# EasyEDA Pro project WCH电调V3.1（OP）.eprj

# Schematic 2024.4.3
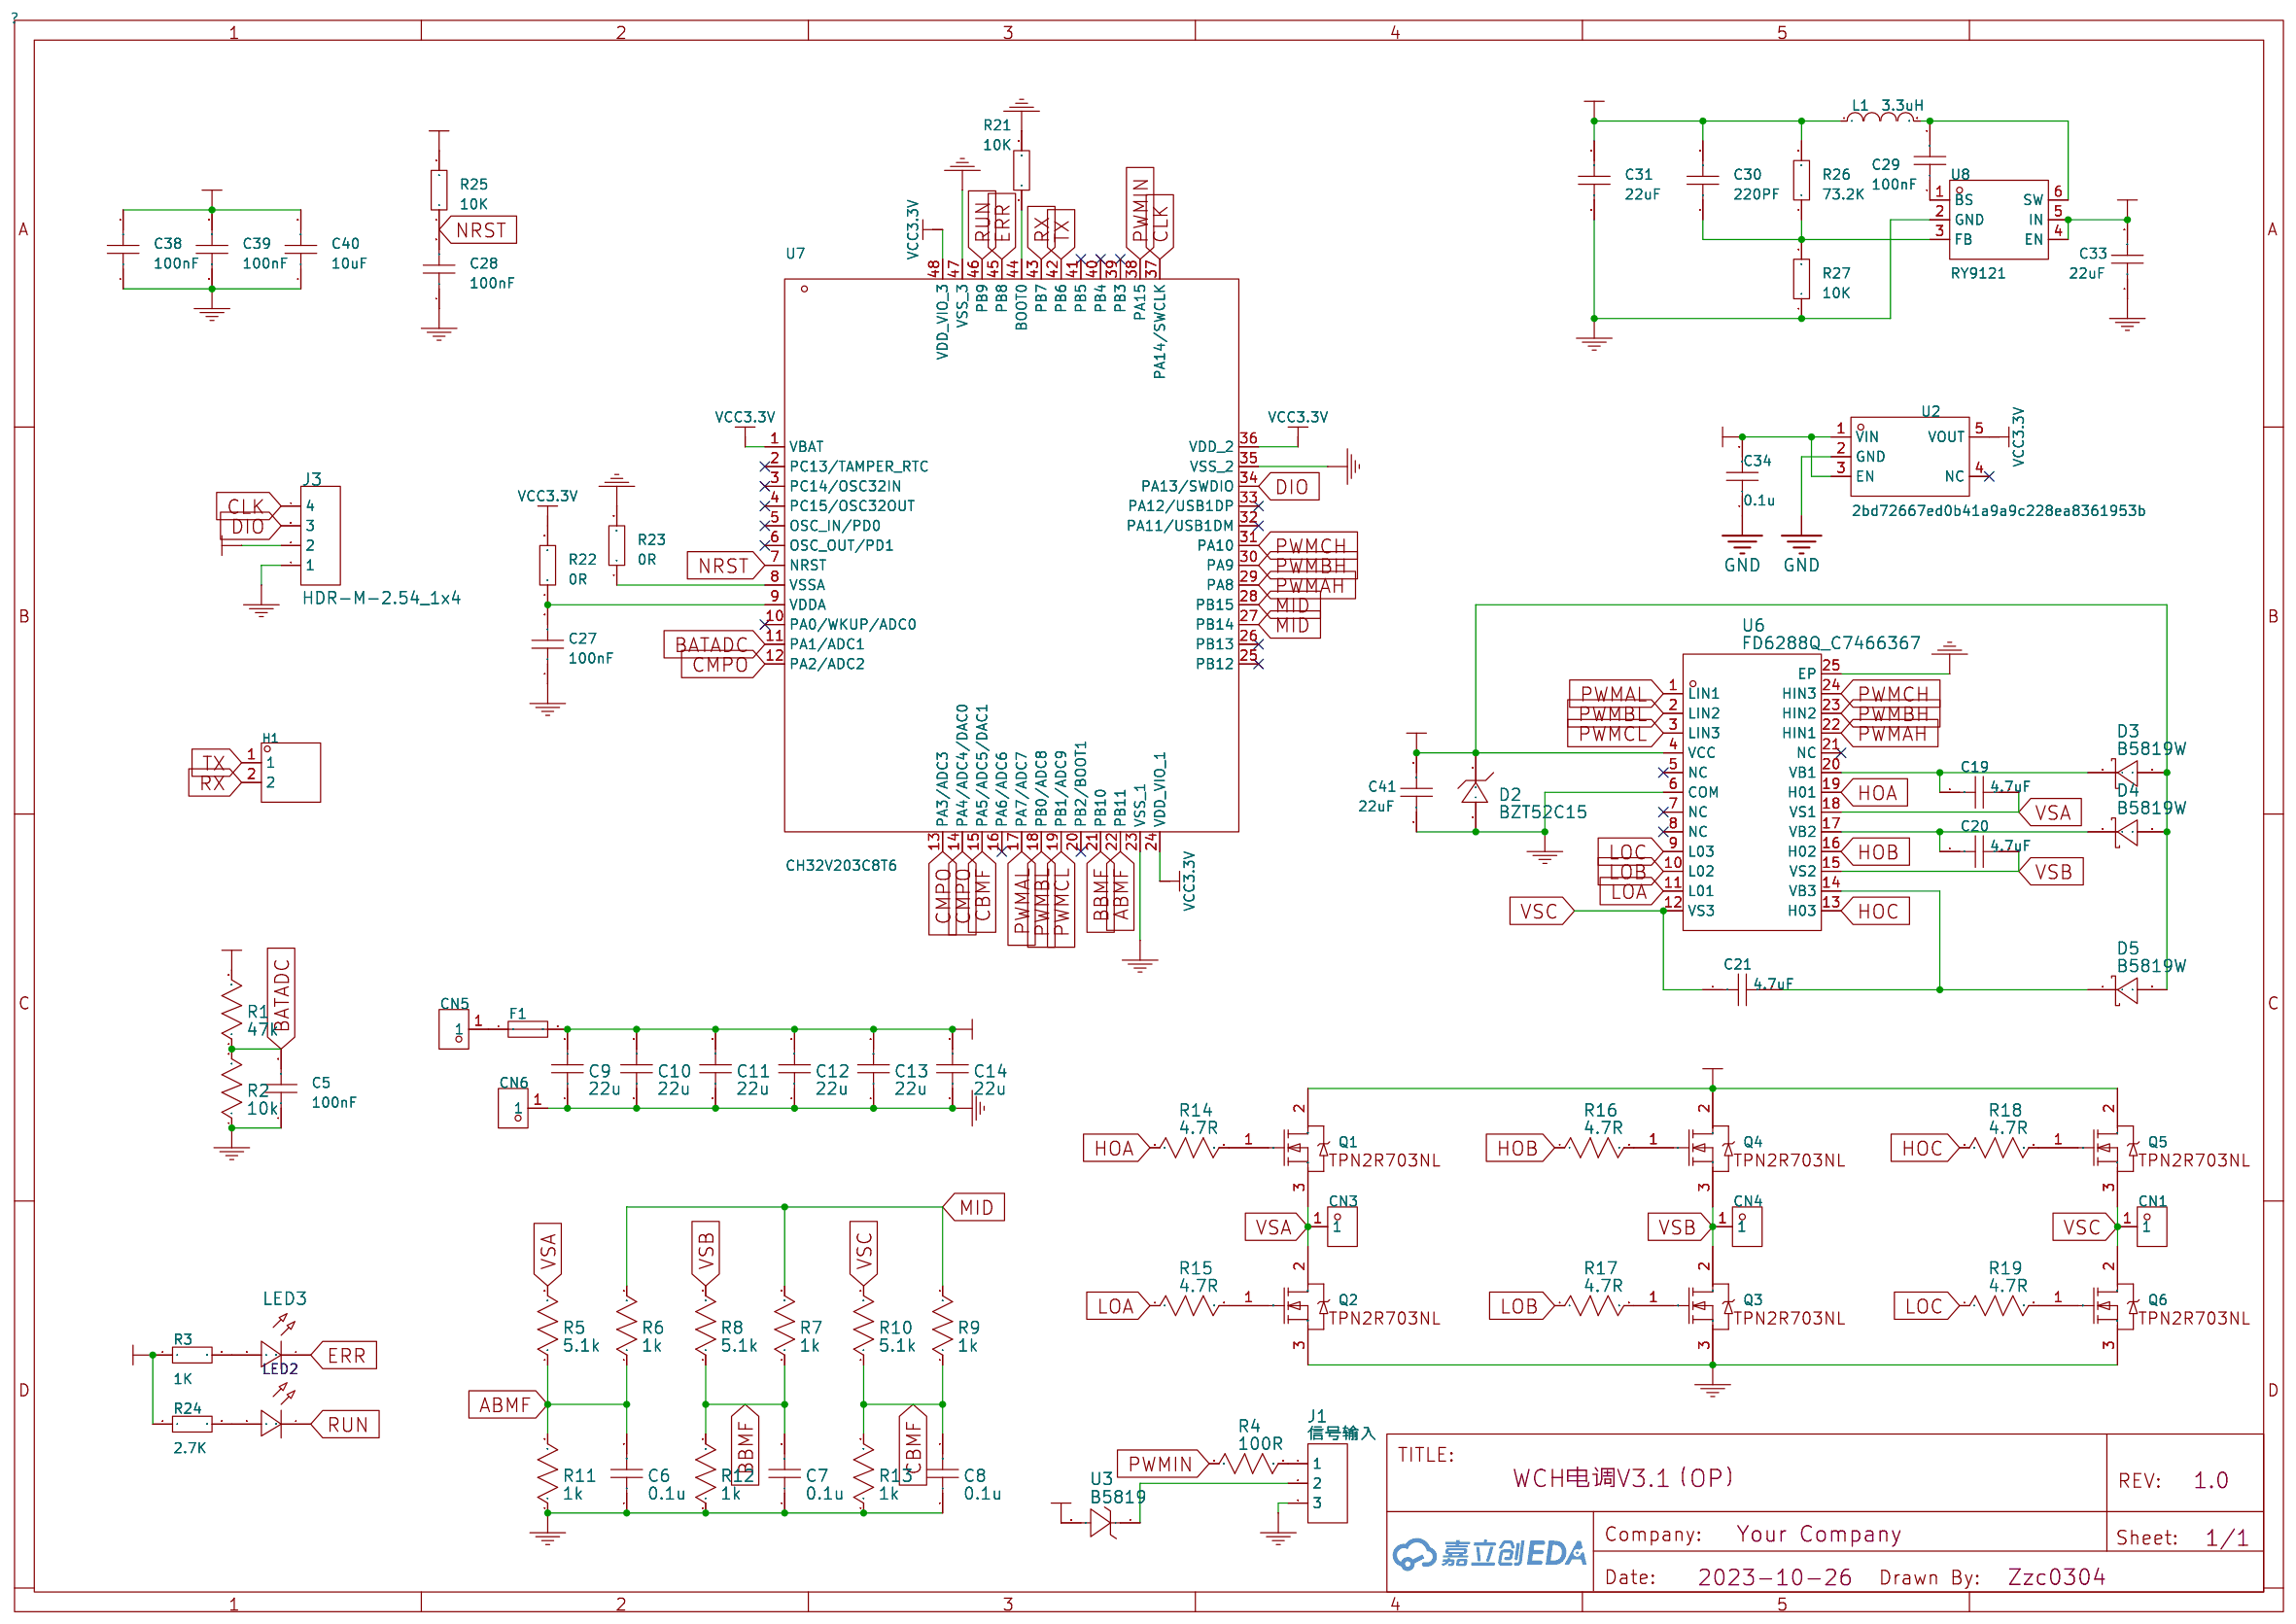
[diagram p0: schematic sheet]

## Parts
C5  100nF  [C0603]
C6  0.1u  [C0603]
C7  0.1u  [C0603]
C8  0.1u  [C0603]
C9  22u  [C0805]
C10  22u  [C0805]
C11  22u  [C0805]
C12  22u  [C0805]
C13  22u  [C0805]
C14  22u  [C0805]
C19  4.7uF  [C0805]
C20  4.7uF  [C0805]
C21  4.7uF  [C0805]
C27  100nF  [C0603]
C28  100nF  [C0603]
C29  100nF  [C0805]
C30  220PF  [C0603]
C31  22uF  [C0805]
C33  22uF  [C0805]
C34  0.1u  [C0603]
C38  100nF  [C0603]
C39  100nF  [C0603]
C40  10uF  [C0805]
C41  22uF  [C0805]
CN1  -  [单端口]
CN3  -  [单端口]
CN4  -  [单端口]
CN5  -  [单端口]
CN6  -  [单端口]
D2  BZT52C15  [SOD-123_L2.7-W1.6-LS3.7-RD]
D3  B5819W  [SOD-123_L2.8-W1.8-LS3.7-RD]
D4  B5819W  [SOD-123_L2.8-W1.8-LS3.7-RD]
D5  B5819W  [SOD-123_L2.8-W1.8-LS3.7-RD]
F1  -  [1808保险丝]
H1  -  [HDR-TH_2P-P2.54-V-M-1]
J1  信号输入  [HDR-M-2.54_1X3]
J3  HDR-M-2.54_1x4  [HDR-M-2.54_1X4]
L1  3.3uH  [L0805]
LED2  -  [LED_0603]
LED3  -  [LED_0603]
Q1  -  [TPN2R703NL]
Q2  -  [TPN2R703NL]
Q3  -  [TPN2R703NL]
Q4  -  [TPN2R703NL]
Q5  -  [TPN2R703NL]
Q6  -  [TPN2R703NL]
R1  47k  [R0603]
R2  10k  [R0603]
R3  1K  [R0603]
R4  100R  [R0603]
R5  5.1k  [R0603]
R6  1k  [R0603]
R7  1k  [R0603]
R8  5.1k  [R0603]
R9  1k  [R0603]
R10  5.1k  [R0603]
R11  1k  [R0603]
R12  1k  [R0603]
R13  1k  [R0603]
R14  4.7R  [R0603]
R15  4.7R  [R0603]
R16  4.7R  [R0603]
R17  4.7R  [R0603]
R18  4.7R  [R0603]
R19  4.7R  [R0603]
R21  10K  [R0603]
R22  0R  [R0603]
R23  0R  [R0603]
R24  2.7K  [R0603]
R25  10K  [R0603]
R26  73.2K  [R0603]
R27  10K  [R0603]
U2  2bd72667ed0b41a9a9c228ea8361953b  [SOT-23-5_L2.9-W1.6-P0.94-LS2.8-BL]
U3  B5819  [SOD-123_L2.7-W1.7-LS3.8-RD]
U6  FD6288Q_C7466367  [QFN-24_L4.0-W4.0-P0.50-BL-EP2.7]
U7  CH32V203C8T6  [LQFP-48_L7.0-W7.0-P0.50-LS9.0-BL]
U8  RY9121  [SOT-23-6_L2.9-W1.6-P0.95-LS2.8-BR]

## Library data of the parts
C5 C27 C28 C30 C34 C38 C39 = CAP_0603: Supplier Footprint: 0603
C6-C8 = 0.1u: link: https://item.szlcsc.com/362304.html; 3DModel: C0603_L1.6-W0.8-H0.8
C9-C14 = 22u: link: https://item.szlcsc.com/373011.html; 3DModel: C0805_L2.0-W1.3-H1.3
C19-C21 C29 C31 C33 C40 C41 = CAP_0805: Supplier Footprint: 0805
CN1 CN3-CN6 = 单端口
D2 = BZT52C15: link: https://item.szlcsc.com/13409.html; 3DModel: SOD-123_L2.7-W1.6-H1.4-LS3.7; Supplier Part: C173427; Supplier: LCSC; Manufacturer: MDD; JLCPCB Part Class: Extended Part
D3-D5 = B5819W: link: https://item.szlcsc.com/301422.html; Supplier: LCSC; Manufacturer: MDD; Supplier Part: C64885; JLCPCB Part Class: Extended Part
F1 = 1808保险丝
H1 = HDR-M_2.54_1x2P: Supplier Part: C124375; Supplier Footprint: 插件
J1 = 信号输入: 3DModel: HDR-M-2.54_1x3; Supplier Part: C180248; Supplier: LCSC
J3 = HDR-M-2.54_1x4: Supplier Part: C124378; Supplier: LCSC
L1 = SLM20123R3MIT: 电感值:3.3uH;精度:±20%;额定电流:850mA;; LCSC Part Name: 3.3uH ±20%; Supplier Part: C206303; Manufacturer: Sunltech(韩国顺磁); Supplier Footprint: 0805; JLCPCB Part Class: 扩展库; Datasheet: https://atta.szlcsc.com/upload/public/pdf/source/20180528/C216156_746607D01E5EB4C50E0D2BE40685D2FE.pdf; Supplier: LCSC; Tolerance: ±20%; Rated Current: 850mA; DC Resistance (DCR): 300mΩ
LED2 = LED_0603-G: Supplier Footprint: 0603
LED3 = LED_0603-R: Supplier Footprint: 0603
Q1-Q6 = TPN2R703NL(V3.1)
R1 = 47k: link: https://www.mouser.in/datasheet/2/447/PYu_RT_1_to_0_01_RoHS_L_11-1669912.pdf
R2 = 10k: link: https://www.mouser.in/datasheet/2/447/PYu_RT_1_to_0_01_RoHS_L_11-1669912.pdf
R3 R21-R27 = Res_0603: Supplier Footprint: 0603
R4 = 100R: link: https://www.mouser.in/datasheet/2/447/PYu_RT_1_to_0_01_RoHS_L_11-1669912.pdf
R5 R8 R10 = 5.1k: link: https://www.mouser.in/datasheet/2/447/PYu_RT_1_to_0_01_RoHS_L_11-1669912.pdf
R6 R7 R9 R11-R19 = 1k: link: https://www.mouser.in/datasheet/2/447/PYu_RT_1_to_0_01_RoHS_L_11-1669912.pdf
U2 = RT9013-33: LCSC Part Name: RT9013-33GU5; Supplier Part: C3034127; Manufacturer: RICHTEK(立锜); Manufacturer Part: RT9013-33GU5; Supplier Footprint: SC-70-5; JLCPCB Part Class: 扩展库; Datasheet: https://atta.szlcsc.com/upload/public/pdf/source/20220613/DD4CF7EAF1F9097C51D5D7DB1A8622BA.pdf; Supplier: LCSC
U3 = B5819: link: https://atta.szlcsc.com/upload/public/pdf/source/20190315/C353562_E8624576AF11855AB906D556FFCD9125.pdf; Supplier: LCSC; Supplier Part: C9900008333; Manufacturer: null; Manufacturer Part: IN5819; JLCPCB Part Class: Extended Part
U6 = FD6288Q_C7466367: link: https://item.szlcsc.com/245167.html; 3DModel: QFN-24_L4.0-W4.0-H0.9-P0.50-; Supplier: LCSC; Supplier Part: C7466367; Manufacturer: JSMSEMI(杰盛微); Manufacturer Part: FD6288Q; JLCPCB Part Class: Extended Part
U7 = CH32V203C8T6: CPU内核:RISC-V;程序存储容量:64KB;RAM总容量:20KB;GPIO端口数量:-;工作电压范围:-;CPU最大主频:144MHz;程序存储器类型:FLASH;; Supplier Part: C3001172; Manufacturer: WCH(南京沁恒); Supplier Footprint: LQFP-48(7x7); JLCPCB Part Class: 扩展库; Datasheet: https://atta.szlcsc.com/upload/public/pdf/source/20220425/D3E728E801B9982E2758AC225E3A30F9.pdf; Supplier: LCSC; CPU Core: RISC-V; Program Storage Size: 64KB; RAM Size: 20KB; CPU Maximum Speed: 144MHz; Program Memory Type: FLASH
U8 = RY9121: 功能类型:降压型;输入电压:4.5V~17V;输出电流(最大值):2A;; Supplier Part: C2887854; Manufacturer: RYCHiP(蕊源); Supplier Footprint: SOT-23-6; JLCPCB Part Class: 扩展库; Datasheet: https://atta.szlcsc.com/upload/public/pdf/source/20210827/DF70F408E950B831DE30F072EB02455F.pdf; Supplier: LCSC; Function: 降压型; Input Voltage: 4.5V~17V; Output Current (Max): 2A; Switching Frequency: 500kHz

## Nets
GND: C5.1 C6.1 C7.1 C8.1 C9.1 C10.1 C11.1 C12.1 C13.1 C14.1 C27.1 C28.1 C31.1 C33.1 C34.1 C38.1 C39.1 C40.1 C41.1 CN6.1 D2.2(A) J1.3 J3.1 Q2.3(S) Q3.3(S) Q6.3(S) R2.1 R11.1 R12.1 R13.1 R21.2 R23.2 R27.1 U2.2(GND) U6.6(COM) U6.25(EP) U7.23(VSS_1) U7.35(VSS_2) U7.47(VSS_3) U8.2(GND)
VBAT: C9.2 C10.2 C11.2 C12.2 C13.2 C14.2 C33.2 C41.2 D2.1(K) D3.2(A) D4.2(A) D5.2(A) F1.2 Q1.2(D) Q4.2(D) Q5.2(D) R1.2 U6.4(VCC) U8.4(EN) U8.5(IN)
VCC3.3V: C38.2 C39.2 C40.2 J3.2 R22.2 R25.2 U2.5(VOUT) U7.1(VBAT) U7.24(VDD_VIO_1) U7.36(VDD_2) U7.48(VDD_VIO_3)
VCC5V: C30.2 C31.2 C34.2 L1.1 R3.1 R24.1 R26.2 U2.1(VIN) U2.3(EN) U3.2(A)
ABMF: C6.2 R5.1 R6.1 R11.2 U7.22(PB11)
BATADC: C5.2 R1.1 R2.2 U7.11(PA1/ADC1)
BBMF: C7.2 R7.1 R8.1 R12.2 U7.21(PB10)
CBMF: C8.2 R9.1 R10.1 R13.2 U7.15(PA5/ADC5/DAC1)
CLK: J3.4 U7.37(PA14/SWCLK)
CMPO: U7.12(PA2/ADC2) U7.13(PA3/ADC3) U7.14(PA4/ADC4/DAC0)
DIO: J3.3 U7.34(PA13/SWDIO)
ERR: LED3.1(C) U7.45(PB8)
HOA: R14.1 U6.19(H01)
HOB: R16.1 U6.16(H02)
HOC: R18.1 U6.13(H03)
LOA: R15.1 U6.11(L01)
LOB: R17.1 U6.10(L02)
LOC: R19.1 U6.9(L03)
MID: R6.2 R7.2 R9.2 U7.27(PB14) U7.28(PB15)
NRST: C28.2 R25.1 U7.7(NRST)
PWMAH: U6.22(HIN1) U7.29(PA8)
PWMAL: U6.1(LIN1) U7.17(PA7/ADC7)
PWMBH: U6.23(HIN2) U7.30(PA9)
PWMBL: U6.2(LIN2) U7.18(PB0/ADC8)
PWMCH: U6.24(HIN3) U7.31(PA10)
PWMCL: U6.3(LIN3) U7.19(PB1/ADC9)
PWMIN: R4.1 U7.38(PA15)
RUN: LED2.1(C) U7.46(PB9)
RX: H1.2 U7.43(PB7)
TX: H1.1 U7.42(PB6)
VSA: C19.2 CN3.1 Q1.3(S) Q2.2(D) R5.2 U6.18(VS1)
VSB: C20.2 CN4.1 Q3.2(D) Q4.3(S) R8.2 U6.15(VS2)
VSC: C21.1 CN1.1 Q5.3(S) Q6.2(D) R10.2 U6.12(VS3)
$1N297: J1.2 U3.1(K)
$1N1021: C20.1 D4.1(K) U6.17(VB2)
$1N1023: C19.1 D3.1(K) U6.20(VB1)
$1N1068: C21.2 D5.1(K) U6.14(VB3)
$1N1283: J1.1 R4.2
$1N21890: R21.1 U7.44(BOOT0)
$1N22241: R23.1 U7.8(VSSA)
$1N22492: C27.2 R22.1 U7.9(VDDA)
$1N22634: LED2.2(A) R24.2
$1N22686: LED3.2(A) R3.2
$1N23270: C29.2 L1.2 U8.6(SW)
$1N23542: C30.1 R26.1 R27.2 U8.3(FB)
$1N39624: CN5.1 F1.1
$1N42500: C29.1 U8.1(BS)
$1N50576: Q1.1(G) R14.2
$1N50603: Q2.1(G) R15.2
$1N50630: Q3.1(G) R17.2
$1N50657: Q4.1(G) R16.2
$1N50684: Q5.1(G) R18.2
$1N50711: Q6.1(G) R19.2

Not connected (* = marked no-connect by the designer): U2 4(NC)*; U6 5(NC)* 7(NC)* 8(NC)* 21(NC)*; U7 2(PC13/TAMPER_RTC)* 3(PC14/OSC32IN)* 4(PC15/OSC32OUT)* 5(OSC_IN/PD0)* 6(OSC_OUT/PD1)* 10(PA0/WKUP/ADC0)* 16(PA6/ADC6)* 20(PB2/BOOT1)* 25(PB12)* 26(PB13)* 32(PA11/USB1DM)* 33(PA12/USB1DP)* 39(PB3)* 40(PB4)* 41(PB5)*

# Board PCB1
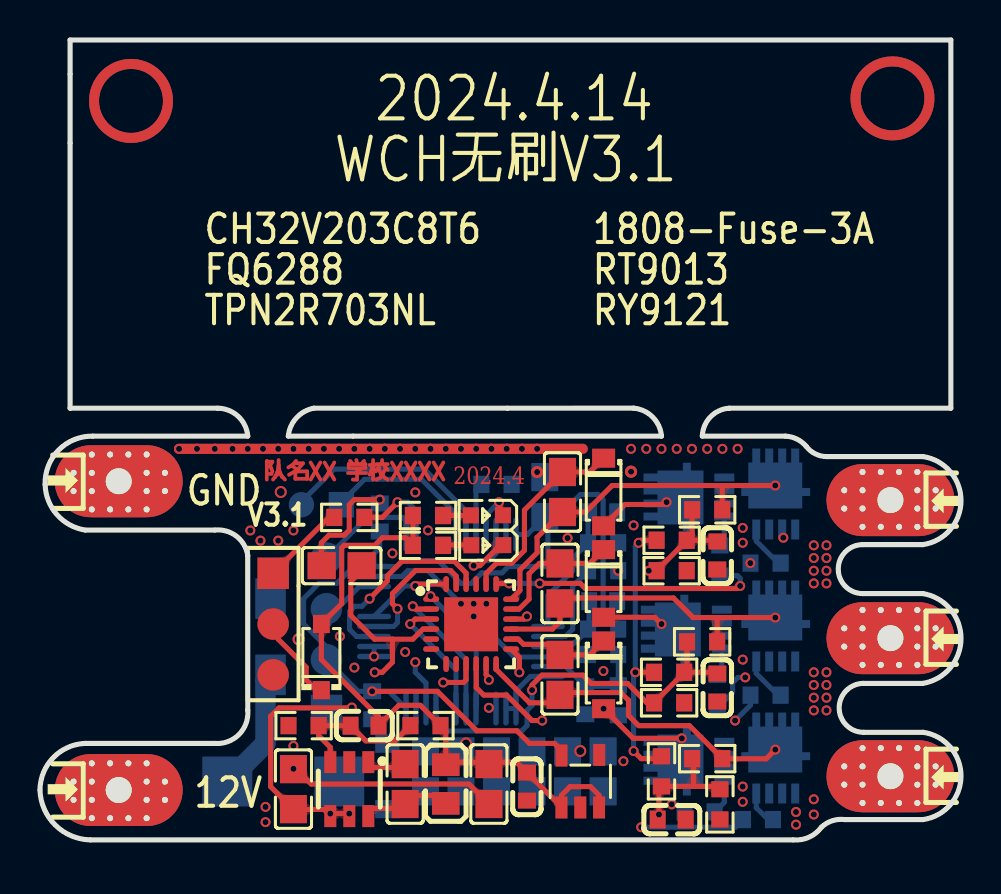
[diagram p1: board, top side]
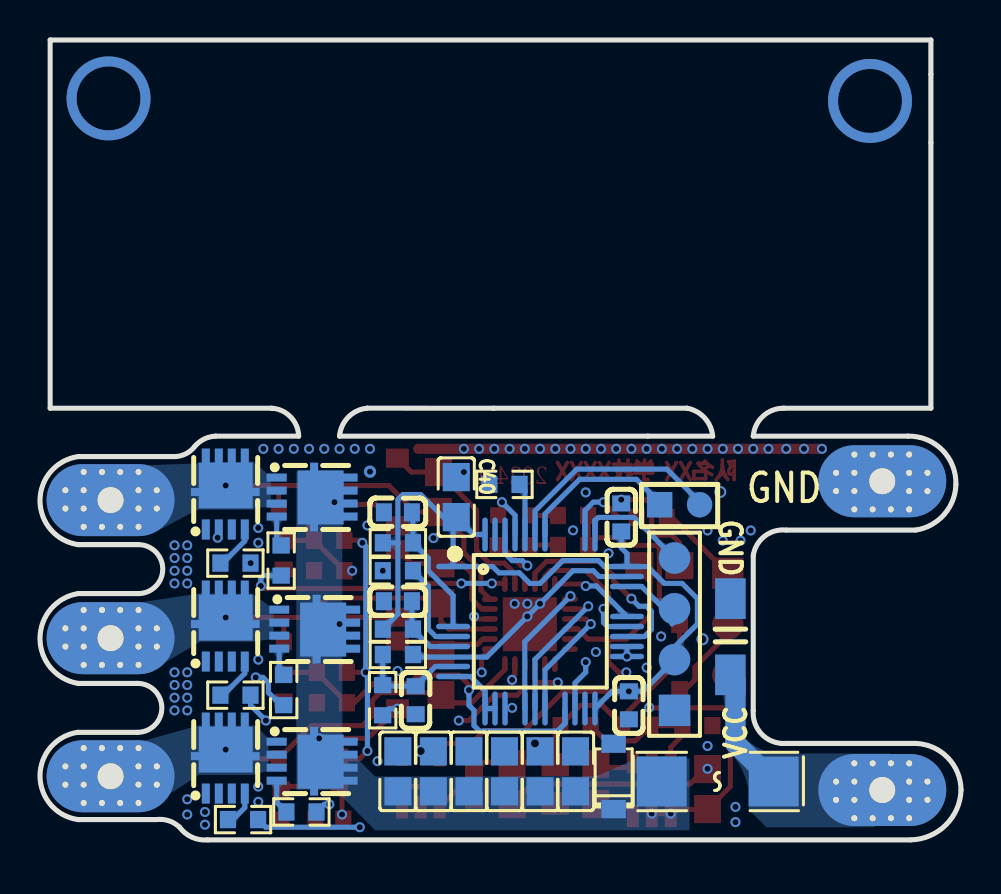
[diagram p2: board, bottom side, seen from below]

Outline 46.09 x 40 mm; copper layers: Top Layer, Inner1, Inner2, Bottom Layer. Coordinates in mm from the lower left corner of the outline.
Outline path: 0,2.49 arc(0.67,4.12) 2.27,4.83 8.75,4.83 arc(9.96,5.27) 10.4,6.48 10.4,14.22 arc(9.83,15.19) 8.74,15.49 2.27,15.49 arc(0.85,16.27) 0.26,17.78 arc(0.94,19.5) 2.65,20.19 10.4,20.19 arc(9.91,21.19) 8.88,21.59 1.51,21.59 1.51,40 45.58,40 45.58,21.59 34.49,21.59 arc(33.55,21.15) 33.14,20.19 37.3,20.19 arc(37.87,20.05) 38.34,19.69 arc(38.79,19.31) 39.36,19.17 44.18,19.17 arc(46.09,16.97) 44.18,14.77 41.17,14.77 arc(39.94,13.54) 41.17,12.32 44.18,12.32 arc(46.08,10.07) 44.18,7.83 41.21,7.83 arc(39.99,6.6) 41.21,5.38 44.2,5.38 arc(46.08,3.19) 44.18,1.02 40.28,1.02 arc(39.65,0.96) 39.1,0.64 arc(38.48,0.13) 37.7,0 2.52,0 arc(0.77,0.74) 0,2.49 ; 12.43,20.19 arc(12.83,21.1) 13.7,21.59 23.39,21.59 29.7,21.59 arc(30.66,21.15) 31.1,20.19 12.43,20.19
Stack: Top Layer 0.035mm 外层铜厚1oz / Dielectric1 0.2104mm 7628 RC49% 8.6mil / Inner1 0.0152mm 内层铜厚 / Dielectric2 1.065mm 1.1mm H/HOZ 含铜 / Inner2 0.0152mm 内层铜厚 / Dielectric3 0.2104mm 7628 RC49% 8.6mil / Bottom Layer 0.035mm 外层铜厚1oz

## Design rules (mm)
template: 自定义配置
spacing copperThickness1oz (default): track to track 0.203, other pairs 0.152 to 0.3
spacing copperThickness2oz: track to track 0.203, other pairs 0.152 to 0.3
track width copperThickness1oz (default): min 0.127, default 0.254, max 3.81
track width copperThickness2oz: min 0.203, default 0.254, max 3.81
differential pair differentialPair (default): width min 0.127, default 0.254, max 2.54; gap min 0.152, default 0.152
via viaSize (default): diameter min 0.5, default 0.61, max 10; hole min 0.305, default 0.305, max 6.299
net GND uses innerPlane1

## Placement (name value [footprint] x y rotation side)
C5  100nF  [C0603]  27.29 6.98 90 bottom
C6  0.1u  [C0603]  33.89 14.22 90 top
C7  0.1u  [C0603]  33.89 7.62 90 top
C8  0.1u  [C0603]  31.61 1.02 180 top
C9  22u  [C0805]  26.4 3.43 270 bottom
C10  22u  [C0805]  28.18 3.43 270 bottom
C11  22u  [C0805]  24.62 3.43 270 bottom
C12  22u  [C0805]  22.84 3.43 270 bottom
C13  22u  [C0805]  21.07 3.43 270 bottom
C14  22u  [C0805]  19.29 3.43 270 bottom
C19  4.7uF  [C0805]  26.15 17.4 270 top
C20  4.7uF  [C0805]  26.02 12.83 270 top
C21  4.7uF  [C0805]  26.02 8.25 90 top
C27  100nF  [C0603]  28.18 11.94 180 bottom
C28  100nF  [C0603]  28.18 16.38 180 bottom
C29  100nF  [C0805]  18.27 2.79 270 top
C30  220PF  [C0603]  16.24 5.72 0 top
C31  22uF  [C0805]  22.46 2.79 90 top
C33  22uF  [C0805]  12.68 2.54 270 top
C34  0.1u  [C0603]  24.37 2.67 90 top
C38  100nF  [C0603]  17 16.13 270 bottom
C39  100nF  [C0603]  16.62 6.73 90 bottom
C40  10uF  [C0805]  25.26 17.14 270 bottom
C41  22uF  [C0805]  15.1 13.72 0 top
CN1  -  [单端口]  42.55 3.18 90 top
CN3  -  [单端口]  42.55 16.99 90 top
CN4  -  [单端口]  42.55 10.09 90 top
CN5  -  [单端口]  3.94 2.49 270 top
CN6  -  [单端口]  3.94 17.94 270 top
D2  BZT52C15  [SOD-123_L2.7-W1.6-LS3.7-RD]  17.38 3.17 90 bottom
D3  B5819W  [SOD-123_L2.8-W1.8-LS3.7-RD]  28.2 17.4 270 top
D4  B5819W  [SOD-123_L2.8-W1.8-LS3.7-RD]  28.2 12.83 270 top
D5  B5819W  [SOD-123_L2.8-W1.8-LS3.7-RD]  28.2 8.25 270 top
F1  -  [1808保险丝]  12.18 2.92 0 bottom
H1  -  [HDR-TH_2P-P2.54-V-M-1]  14.08 16.76 180 bottom
J1  信号输入  [HDR-M-2.54_1X3]  11.67 10.8 270 top
J3  HDR-M-2.54_1x4  [HDR-M-2.54_1X4]  14.33 10.29 90 bottom
L1  3.3uH  [L0805]  20.3 2.79 270 top
LED2  -  [LED_0603]  22.34 14.73 180 top
LED3  -  [LED_0603]  22.31 16.23 180 top
NOREF  -  [Pad_e16151]  11.54 8.25 0 top
NOREF#2  -  [Pad_e16153]  11.54 12.06 0 top
Q1  -  [TPN2R703NL]  32.37 17.14 270 bottom
Q2  -  [TPN2R703NL]  36.81 17.4 180 bottom
Q3  -  [TPN2R703NL]  36.81 10.8 180 bottom
Q4  -  [TPN2R703NL]  32.24 10.54 270 bottom
Q5  -  [TPN2R703NL]  32.37 3.94 270 bottom
Q6  -  [TPN2R703NL]  36.81 4.19 180 bottom
R1  47k  [R0603]  28.94 6.98 270 bottom
R2  10k  [R0603]  28.18 9.27 0 bottom
R3  1K  [R0603]  19.41 16.22 0 top
R4  100R  [R0603]  15.48 16.13 180 top
R5  5.1k  [R0603]  33.38 16.51 0 top
R6  1k  [R0603]  31.61 14.99 180 top
R7  1k  [R0603]  31.48 8.38 180 top
R8  5.1k  [R0603]  33.13 9.91 0 top
R9  1k  [R0603]  31.1 3.43 90 top
R10  5.1k  [R0603]  33.38 4.06 0 top
R11  1k  [R0603]  31.61 13.46 180 top
R12  1k  [R0603]  31.48 6.86 180 top
R13  1k  [R0603]  34.02 1.78 90 top
R14  4.7R  [R0603]  34.02 13.97 90 bottom
R15  4.7R  [R0603]  36.31 13.84 0 bottom
R16  4.7R  [R0603]  33.89 7.49 90 bottom
R17  4.7R  [R0603]  36.31 7.24 0 bottom
R18  4.7R  [R0603]  33 1.4 0 bottom
R19  4.7R  [R0603]  35.92 1.02 0 bottom
R21  10K  [R0603]  22.84 17.78 0 bottom
R22  0R  [R0603]  28.18 10.54 0 bottom
R23  0R  [R0603]  28.18 13.46 0 bottom
R24  2.7K  [R0603]  19.41 14.73 0 top
R25  10K  [R0603]  28.18 14.86 0 bottom
R26  73.2K  [R0603]  19.29 5.72 0 top
R27  10K  [R0603]  13.19 5.72 0 top
U2  2bd72667ed0b41a9a9c228ea8361953b  [SOT-23-5_L2.9-W1.6-P0.94-LS2.8-BL]  27.03 2.92 0 top
U3  B5819  [SOD-123_L2.7-W1.7-LS3.8-RD]  14.08 9.14 90 top
U6  FD6288Q_C7466367  [QFN-24_L4.0-W4.0-P0.50-BL-EP2.7]  21.57 10.8 270 top
U7  CH32V203C8T6  [LQFP-48_L7.0-W7.0-P0.50-LS9.0-BL]  21.07 10.92 270 bottom
U8  RY9121  [SOT-23-6_L2.9-W1.6-P0.95-LS2.8-BR]  15.48 2.54 90 top

## Footprints (pads in the part's own frame, mm; a bottom-side part is the same pattern mirrored in y, then rotated)
1808保险丝
  rect 2.5x2.5 smd: 1(-2.8,0) 2(2.8,0)
C0603
  rect 0.8x0.9 smd: 1(-0.7,0) 2(0.7,0)
C0805
  rect 1.41x1.35 smd: 1(-1,0) 2(1,0)
HDR-M-2.54_1X3
  rect 1.575x1.575 smd: 1(-2.54,0)
  round 1.575 smd: 2(0,0) 3(2.54,0)
HDR-M-2.54_1X4
  rect 1.575x1.575 smd: 1(-3.81,0)
  round 1.575 smd: 2(-1.27,0) 3(1.27,0) 4(3.81,0)
HDR-TH_2P-P2.54-V-M-1
  rect 1.27x1.27 smd: 1(-1,0)
  round 1.27 smd: 2(1,0)
L0805
  rect 1.133x1.377 smd: 1(-0.966,0) 2(0.966,0)
LED_0603
  rect 0.8x0.8 smd: 1(-0.851,-0.01) 2(0.75,-0.005)
LQFP-48_L7.0-W7.0-P0.50-LS9.0-BL
  oval 0.27x1.7 smd: 1(-2.75,-4.35) 7(0.25,-4.35) 8(0.75,-4.35) 9(1.25,-4.35) 11(2.25,-4.35) 12(2.75,-4.35) 27(1.75,4.35) 28(1.25,4.35) 29(0.75,4.35) 30(0.25,4.35) 31(-0.25,4.35) 34(-1.75,4.35) 35(-2.25,4.35) 36(-2.75,4.35)
  oval 1.7x0.27 smd: 13(4.35,-2.75) 14(4.35,-2.25) 15(4.35,-1.75) 17(4.35,-0.75) 18(4.35,-0.25) 19(4.35,0.25) 21(4.35,1.25) 22(4.35,1.75) 23(4.35,2.25) 24(4.35,2.75) 37(-4.35,2.75) 38(-4.35,2.25) 42(-4.35,0.25) 43(-4.35,-0.25) 44(-4.35,-0.75) 45(-4.35,-1.25) 46(-4.35,-1.75) 47(-4.35,-2.25) 48(-4.35,-2.75)
Pad_e16151
  rect 1.524x2.032 smd far side: 1(0,0)
Pad_e16153
  rect 1.524x2.032 smd far side: 1(0,0)
QFN-24_L4.0-W4.0-P0.50-BL-EP2.7
  oval 0.28x0.8 smd: 1(-1.25,-2) 2(-0.75,-2) 3(-0.25,-2) 4(0.25,-2) 5(0.75,-2) 6(1.25,-2) 13(1.25,2) 14(0.75,2) 15(0.25,2) 16(-0.25,2) 17(-0.75,2) 18(-1.242,2)
  oval 0.8x0.28 smd: 7(2,-1.25) 8(2,-0.75) 9(2,-0.25) 10(2,0.25) 11(2,0.75) 12(2,1.25) 19(-2,1.25) 20(-2,0.75) 21(-2,0.25) 22(-2,-0.25) 23(-2,-0.75) 24(-2,-1.25)
  rect 2.7x2.7 smd: 25(0.013,0)
R0603
  rect 0.806x0.864 smd: 1(-0.753,0) 2(0.753,0)
SOD-123_L2.7-W1.6-LS3.7-RD
  rect 0.91x1.22 smd: 1(-1.635,0) 2(1.635,0)
SOD-123_L2.7-W1.7-LS3.8-RD
  rect 0.91x0.84 smd: 1(-1.655,0) 2(1.655,0)
SOD-123_L2.8-W1.8-LS3.7-RD
  rect 0.95x1.15 smd: 1(-1.692,0) 2(1.692,0)
SOT-23-5_L2.9-W1.6-P0.94-LS2.8-BL
  rect 0.6x1.1 smd: 1(-0.94,-1.3) 2(0,-1.3) 3(0.94,-1.3) 4(0.95,1.329) 5(-0.94,1.3)
SOT-23-6_L2.9-W1.6-P0.95-LS2.8-BR
  rect 1.1x0.6 smd: 1(1.35,-0.95) 2(1.35,0) 3(1.35,0.95) 4(-1.35,0.95) 5(-1.35,0) 6(-1.35,-0.95)
TPN2R703NL
  rect 0.4x1 smd: 1(0.975,-1.875) 2(-0.975,1.675) 2(-0.325,1.675) 2(0.325,1.675) 2(0.975,1.675) 3(-0.975,-1.875) 3(-0.325,-1.875) 3(0.325,-1.875)
  rect 0.6x0.4 smd: 2(-1.42,0) 2(1.42,0)
  rect 2.7x2.3 smd: 2(0.02,0.325)
单端口
  round 0.61 hole 0.305: 1(-1.335,1.397) 1(-1.335,0.482) 1(-1.335,-0.432) 1(-1.335,-1.346) 1(-0.421,2.312) 1(-0.421,1.397) 1(-0.421,-1.346) 1(-0.421,-2.26) 1(0.493,2.312) 1(0.493,1.397) 1(0.493,-1.346) 1(0.493,-2.26) 1(1.407,1.397) 1(1.407,0.482) 1(1.407,-0.432) 1(1.407,-1.346)
  oval 3.6x6.4 hole 1.3: 1(0,0)

## Nets
As in the schematic, except:
GND: C5.1 C6.1 C7.1 C8.1 C9.1 C10.1 C11.1 C12.1 C13.1 C14.1 C27.1 C28.1 C31.1 C33.1 C34.1 C38.1 C39.1 C40.1 C41.1 CN6.1 D2.2 J1.3 J3.1 NOREF#2.1 Q2.3 Q3.3 Q6.3 R2.1 R11.1 R12.1 R13.1 R21.2 R23.2 R27.1 U2.2 U6.6 U6.25 U7.23 U7.35 U7.47 U8.2
$1N39624: CN5.1 F1.1 NOREF.1

Pads without a net: U2 4; U6 5 7 8 21

## Via types
v1: diameter 4.2, hole 3.2, Top Layer to Bottom Layer, 2 vias
v2: diameter 0.5, hole 0.305, Top Layer to Bottom Layer, 121 vias
v3: diameter 0.61, hole 0.305, Top Layer to Bottom Layer, 2 vias
v4: diameter 0.6, hole 0.4, Top Layer to Bottom Layer, 4 vias
v5: diameter 0.5, hole 0.304, Top Layer to Bottom Layer, 4 vias

## Routing (per net, layer and track width the routed paths; a pad name or vN(x,y) marks a point on that pad's centre or on a via; arc(x,y) is an arc through that point)
GND: length 49.1
  Top Layer w0.254: 12.68,3.68 13.57,2.79 21.46,2.79 C31.1 ; C41.1 14.08,13.73 14.08,14.86 14.46,15.24 15.22,15.24 15.48,15.49 15.48,16.76 15.73,17.02 v2(17,17.02)
  Top Layer w0.508: v2(6.96,19.56) v2(7.86,19.56) v2(8.75,19.56) v2(9.64,19.56) v2(10.4,19.56) v2(11.16,19.56) v2(11.92,19.56) v2(12.68,19.56) v2(13.45,19.56) v2(14.21,19.56) v2(14.97,19.56) v2(15.73,19.56) v2(16.49,19.56) v2(17.26,19.56) v2(18.02,19.56) v2(18.78,19.56) v2(19.54,19.56) v2(20.3,19.56) v2(21.07,19.56) v2(21.83,19.56) v2(22.59,19.56) v2(23.35,19.56) v2(24.11,19.56) v2(24.88,19.56) 27.16,19.56
  Bottom Layer w0.254: R2.1 27.3,9.14 23.73,9.14 v2(21.7,11.18) v2(21.07,11.81) 19.41,13.46 18.4,13.46 18.11,13.17 U7.35
  vias: v2(10.52,15.48) v2(11.03,14.97) v2(11.29,1.65) v2(11.29,0.89) v2(11.92,14.97) v2(12.68,15.48) v2(12.68,4.7) v2(12.68,3.56) v2(15.01,10.18) v2(15.73,8.62) v2(17.64,14.33) v2(18.27,9.4) v2(18.78,17.38) v2(19.41,15.48) v2(21.7,11.81) v2(22.34,11.81) v2(26.4,15.09) v2(28.19,8.45) v2(28.93,13.46) v2(29.19,3.94) v2(29.57,19.56) v2(29.7,15.73) v2(30.34,19.56) v2(31.1,19.56) v2(31.86,19.56) v2(32.62,19.56) v2(33.38,19.56) v2(34.15,19.56) v2(34.91,19.56) v2(35.16,15.6) v2(35.16,14.86) v2(35.16,9.02) v2(35.16,2.67) v2(35.16,1.91) v2(37.19,15.11) v2(37.83,1.4) v2(37.83,0.76) v2(38.72,14.73) v2(38.72,14.1) v2(38.72,13.46) v2(38.72,12.83) v2(38.72,8.38) v2(38.72,7.75) v2(38.72,7.11) v2(38.72,6.48) v2(38.72,2.03) v2(38.72,1.27) v2(39.35,14.73) v2(39.35,14.1) v2(39.35,13.46) v2(39.35,12.83) v2(39.35,8.38) v2(39.35,7.75) v2(39.35,7.11) v2(39.35,6.48) v3(24.88,18.4) v3(29.57,18.42) v4(12.05,17.4) v4(12.94,10.03) v4(21.32,4.83) v4(27.03,4.45)
VBAT: length 36
  Top Layer w0.254: 16.1,13.46 15.55,12.92 15.55,11.23 16.74,10.04 17.64,10.04 ; D4.2 30.76,11.13 v2(31.1,10.8) ; U6.4 19.16,10.55 18.66,10.04 17.64,10.04 ; 15.48,6.6 11.96,6.6 11.54,6.19 11.54,2.67 12.68,1.52 14.21,1.52 14.53,1.2 U8.4 ; v2(14.53,1.32) 15.35,1.32 U8.5 ; v2(32.11,5.08) 29.68,5.08 v2(28.2,6.56) ; 17.64,10.04 17.64,8.89 17.13,8.38 v2(16.75,8.38) ; v2(31.35,16.89) 31.24,16.78 29.27,16.78 D3.2
  Inner2 w0.254: v2(16.75,8.38) 15.6,7.24 v2(15.6,6.62)
  Bottom Layer w0.254: v2(28.2,6.56) 28.61,6.56 R1.2
  vias: v2(15.48,1.32)
VCC3.3V: length 50.3
  Top Layer w0.254: v2(16.62,7.43) 19.89,7.43 21.86,5.46 23.86,5.46 24.49,4.83 25.74,4.83 26.09,4.47
  Bottom Layer w0.254: U7.36 17.85,13.67 18.14,13.97 19.92,13.97 21.07,12.83 21.57,12.83 22.1,13.36 23.12,13.36 23.43,13.67 U7.1 25.42,15.99 C40.2 ; U7.36 15.69,13.67 14.84,12.83 13.95,12.83 13.19,12.06 13.19,10.8 14.33,9.65 J3.2 15.92,7.43 v2(16.62,7.43) 17.46,7.43 U7.24 ; U7.36 16.72,14.32 17,14.61 C38.2 ; C40.2 25.91,16.14 27.04,17.27 27.92,17.27 28.18,17.02 28.18,14.86 ; C40.2 24.38,15.27 U7.48 ; R22.2 28.18,11.29 28.18,14.86 ; R25.2 28.18,14.86
VCC5V: length 32.2
  Top Layer w0.254: 26.09,1.64 C34.2 23.85,3.89 20.3,3.89 20.3,5.45 R26.2 20.04,5.72 19.03,6.73 17.96,6.73 C30.2 16.94,6.16 14.08,9.02 U3.2 15.1,11.81 15.1,14.61 15.22,14.73 16.75,14.73 17.13,15.11 18.28,15.11 R24.1 ; 26.09,1.64 U2.1 ; 26.09,1.64 26.09,2.23 26.53,2.67 27.54,2.67 27.97,2.23 U2.3 ; R24.1 R3.1 ; R24.1 18.66,14.48
(no net):
  vias: v1(4.56,36.96) v1(42.66,37.08)
ABMF: length 22
  Top Layer w0.254: 32.23,14.99 R6.1 ; R6.1 32.63,15.26 R5.1 ; R6.1 32.36,14.97 R11.2 v2(30.46,13.46) ; R6.1 33.83,14.99 C6.2
  Inner2 w0.254: v2(30.46,13.46) 29.19,12.19 23.73,12.19 21.57,10.03 19.92,10.03 v2(18.78,8.89)
  Bottom Layer w0.254: U7.22 19.32,7.85 18.78,8.38 v2(18.78,8.89)
BATADC: length 5.4
  Bottom Layer w0.254: U7.11 26.3,8.67 C5.2 28.89,7.69 R1.1 28.94,9.14 28.93,9.14
BBMF: length 20
  Top Layer w0.254: R8.1 32.38,8.53 R7.1 ; R7.1 32.23,8.36 R12.2 30.37,6.86 29.4,7.82 27.58,7.82 27.16,8.24 25.11,8.24 24.62,7.75 v5(24.62,7.49) ; R7.1 33.83,8.38 C7.2
  Bottom Layer w0.254: v5(24.62,7.49) 24.62,6.73 24.37,6.48 24.37,5.72 24.09,5.44 20.19,5.44 19.82,5.82 U7.21
CBMF: length 16.9
  Top Layer w0.254: v2(30.97,1.27) 30.97,2.55 30.84,2.68 ; 32.7,2.68 32.7,3.99 R10.1 ; 32.7,2.68 33.88,2.68 R13.2 ; 32.7,2.68 R9.1
  Inner2 w0.254: 30.84,1.14 30.46,1.14 30.34,1.27 27.16,1.27 22.46,5.97 v5(22.46,6.6)
CLK: length 5.6
  Bottom Layer w0.254: J3.4 16.37,16.13 18.14,16.13 18.32,15.96 U7.37
CMPO: length 3.3
  Bottom Layer w0.254: U7.14 U7.13 23.82,7.45 24.54,8.17 U7.12
DIO: length 3.2
  Bottom Layer w0.254: U7.34 15.98,12.67 14.46,11.15 14.46,10.8
ERR: length 2.6
  Top Layer w0.254: v2(22.97,16.89) 23.02,16.84 23.02,16.38 23.16,16.24
  Bottom Layer w0.254: v2(22.97,16.89) 22.32,16.24 U7.45
HOA: length 13.8
  Top Layer w0.254: v2(23.48,12.83) 22.86,12.83 U6.19 ; v2(25,12.83) 27.03,12.83 27.29,12.57 34.91,12.57 v2(35.04,12.7)
  Bottom Layer w0.254: v2(35.04,12.7) 35.04,13.08 34.9,13.22 R14.1 ; v2(23.48,12.83) v2(25,12.83)
HOB: length 15.3
  Top Layer w0.254: v2(24.37,11.18) 24.24,11.05 U6.16
  Inner2 w0.254: v2(35.29,8.13) 32.62,8.13 29.57,11.18 v2(24.37,11.18)
  Bottom Layer w0.254: v2(35.29,8.13) 34.93,8.13 34.65,7.85 34.65,7.37 34.03,6.74 R16.1
HOC: length 13.9
  Top Layer w0.254: v5(23.99,8.38) 23.99,9.13 U6.13
  Inner2 w0.254: v2(31.61,1.78) 30.97,2.41 27.54,2.41 23.99,5.97 v5(23.99,8.38)
  Bottom Layer w0.254: R18.1 31.87,1.78 v2(31.61,1.78)
LOA: length 17.6
  Top Layer w0.254: U6.11 22.32,8.27 22.46,8.13 v5(22.46,8)
  Inner2 w0.254: v5(22.46,8) 22.72,8.25 22.72,10.41 24.01,11.71 29.98,11.71 31.48,13.21 34.15,13.21 34.78,13.84 v2(35.54,13.84)
LOB: length 16.7
  Top Layer w0.254: U6.10 21.83,8.79 21.83,7.62 22.21,7.24 23.35,7.24 24.62,5.97 v2(25.13,5.97)
  Inner2 w0.254: v2(25.13,5.97) 27.03,5.97 27.42,5.59 29.32,5.59 29.7,5.97 v2(34.78,5.97)
  Bottom Layer w0.254: v2(34.78,5.97) 35.55,6.74 R17.1
LOC: length 20.5
  Top Layer w0.254: U6.9 21.32,8.79 21.32,8 21.19,7.87 v2(20.18,7.87)
  Inner2 w0.254: v2(20.18,7.87) 20.18,7.24 26.78,0.64 v2(30.08,0.64)
  Bottom Layer w0.254: R19.1 34.79,0.64 v2(30.08,0.64)
MID: length 30.2
  Top Layer w0.254: v2(29.96,14.86) 30.08,14.99 R6.2 ; 29.83,8.38 R7.2 ; 30.84,4.18 30.73,4.06 30.08,4.06 v2(29.7,4.45)
  Inner2 w0.254: 29.83,8.38 29.19,9.02 23.61,9.02 23.22,8.64 23.22,7.75 22.84,7.37 21.95,7.37 20.68,8.64 19.8,8.64 19.03,7.87 18.01,7.87 v2(16.72,9.17)
  Bottom Layer w0.254: U7.28 v2(16.72,9.17) ; v2(29.96,14.86) 29.79,14.69 v2(29.79,8.38) 29.7,8.3 v2(29.7,4.45)
NRST: length 6.6
  Bottom Layer w0.254: U7.7 25.42,12.22 26.65,13.46 26.65,14.09 R25.1 27.42,16.33 C28.2
PWMAH: length 10.1
  Top Layer w0.254: v2(16.49,12.06) 17.38,12.95 17.38,13.21 18.11,13.93 20.6,13.93 20.6,13.93 20.73,13.93 21.32,13.34 U6.22
  Bottom Layer w0.254: U7.29 15.85,10.17 15.49,10.53 15.49,11.43 15.75,11.68 16.11,11.68 v2(16.49,12.06)
PWMAL: length 6.7
  Top Layer w0.254: v2(19.54,12.19) 19.54,12.08 U6.1
  Bottom Layer w0.254: U7.17 21.83,6.58 21.83,9.91 v2(19.54,12.19)
PWMBH: length 7
  Top Layer w0.254: v2(17.89,11.56) 17.64,11.81 17.64,12.32 18.79,13.47 20.54,13.47 20.82,13.2 U6.23
  Bottom Layer w0.254: v2(17.89,11.56) 17.89,10.87 17.69,10.67 U7.30
PWMBL: length 7.2
  Top Layer w0.254: U6.2 18.79,11.55 v2(18.65,11.68)
  Bottom Layer w0.254: U7.18 21.32,9.02 v2(18.65,11.68)
PWMCH: length 4.3
  Top Layer w0.254: U6.24 18.87,12.8 v2(18.78,12.7)
  Bottom Layer w0.254: v2(18.78,12.7) 18.24,12.7 U7.31
PWMCL: length 6.3
  Top Layer w0.254: U6.3 18.78,11.05 v2(18.53,10.8)
  Bottom Layer w0.254: v2(18.53,10.8) 20.82,8.5 U7.19
PWMIN: length 4.3
  Top Layer w0.254: v2(17.89,16.89) 17.13,16.13 R4.1
  Bottom Layer w0.254: U7.38 18.82,16.47 18.4,16.89 v2(17.89,16.89)
RUN: length 4.2
  Top Layer w0.254: v2(21.7,13.72) 22.01,13.72 23.03,14.74 LED2.1
  Bottom Layer w0.254: U7.46 22.82,14.32 22.46,13.97 21.95,13.97 v2(21.7,13.72)
RX: length 11.6
  Bottom Layer w0.254: U7.43 21.31,16.45 19.23,18.54 14.72,18.54 13.08,16.91 13.08,16.26
TX: length 8.6
  Bottom Layer w0.254: U7.42 20.82,16.31 19.09,18.03 16.24,18.03 15.08,16.88 15.08,16.26
VSA: length 17.8
  Top Layer w0.254: 34.11,17.72 28.63,17.72 27.3,16.4 C19.2 24.88,15.13 24.88,14.36 24.02,13.5 24.02,12.48 U6.18 ; 34.11,17.72 34.14,17.7 R5.2 ; 34.11,17.72 v2(36.79,17.72)
VSB: length 16
  Top Layer w0.254: U6.15 25.64,10.55 26.02,10.92 C20.2 26.29,12.1 31.7,12.1 32.68,11.12 33.85,11.12 ; 33.85,11.12 v2(36.79,11.12) ; 33.85,11.12 33.88,11.08 R8.2
VSC: length 17.1
  Top Layer w0.254: v2(36.79,4.52) 36.33,4.06 34.16,4.06 32.5,5.72 29.96,5.72 29.45,6.22 29.45,6.98 29.07,7.37 26.13,7.37 C21.1 25.62,6.86 24.49,6.86 22.82,8.53 U6.12
$1N297: length 4.3
  Top Layer w0.254: 11.92,10.8 11.92,10.03 13.32,8.64 13.32,8 13.83,7.49 U3.1
$1N1021: length 6.6
  Top Layer w0.254: U6.17 23.97,11.55 24.47,12.04 24.47,13.31 24.99,13.83 C20.1 27.51,13.83 D4.1
$1N1023: length 10
  Top Layer w0.254: U6.20 22.32,13.32 22.84,13.84 23.61,13.84 24.24,14.48 24.24,16.49 C19.1 27.51,18.4 D3.1
$1N1068: length 5.2
  Top Layer w0.254: U6.14 23.93,10.05 24.2,9.78 25.49,9.78 C21.2 27.51,9.25 D5.1
$1N1283: length 4.2
  Top Layer w0.254: J1.1 14.46,16.13 R4.2
$1N21890: length 2.6
  Bottom Layer w0.254: R21.1 21.82,17.51 U7.44
$1N22241: length 4.6
  Bottom Layer w0.254: R23.1 26.65,12.69 26.65,10.54 26.28,10.17 U7.8
$1N22492: length 3.8
  Bottom Layer w0.254: C27.2 27.48,10.59 R22.1 27.42,10.51 26.89,9.98 26.87,9.98 26.56,9.67 U7.9
$1N22634: length 1.7
  Top Layer w0.254: 21.66,14.61 21.53,14.75 20.44,14.75 20.17,14.48
$1N22686: length 1.4
  Top Layer w0.254: R3.2 21.56,16.22 LED3.2
$1N23270: length 4.3
  Top Layer w0.254: 16.43,1.57 17.62,1.57 18.27,2.22 20.04,2.22 20.3,1.95
$1N23542: length 6.9
  Top Layer w0.254: R26.1 18.53,5.72 17.76,4.95 16.3,4.95 C30.1 R27.2 13.94,5.22 14.53,4.63 14.53,4.27
$1N39624: length 6.2
  Bottom Layer w1.016: NOREF.1 11.29,8 11.29,4.83 F1.1
$1N42500: length 2.5
  Top Layer w0.254: 16.43,4.27 16.43,3.62 18.27,3.62
$1N50576: length 1.6
  Bottom Layer w0.254: 34.15,14.6 34.24,14.69 Q1.1
$1N50603: length 2.2
  Bottom Layer w0.254: 37.06,13.97 36.81,13.97 35.84,14.95 Q2.1
$1N50630: length 2.3
  Bottom Layer w0.254: 35.84,9.04 35.84,8.32 36.8,7.37 37.06,7.37
$1N50657: length 1.5
  Bottom Layer w0.254: 34.15,8.12 34.12,8.15 Q4.1
$1N50684: length 1.8
  Bottom Layer w0.254: Q5.1 34.24,1.88 R18.2
$1N50711: length 2
  Bottom Layer w0.254: 36.81,0.89 36.56,0.89 35.84,1.61 Q6.1

## Copper pours and planes (outline as drawn; the poured copper is in the pictures)
GND on Top Layer: -0.27,19.94 41.89,19.94 41.89,-1.4 -0.27,-1.4
GND on Bottom Layer: -0.14,19.56 42.02,19.56 42.02,-1.65 -0.14,-1.65
GND on Inner1: 0.26,39.75 45.32,39.75 45.32,0.25 0.26,0.25
GND on Inner2: -0.27,19.81 41.89,19.81 41.89,-1.4 -0.27,-1.4
VBAT on Bottom Layer: 13.59,4.07 29.32,4.07 29.32,0.48 13.59,0.48
VBAT on Bottom Layer: 29.32,4.27 32.89,4.27 32.89,0.49 29.32,0.49
VBAT on Bottom Layer: 30.96,18.42 33.26,18.42 33.26,2.49 30.96,2.49
VSA on Bottom Layer: 34.53,18.92 41.16,18.92 41.16,15.37 34.53,15.37
VSA on Inner2: 33.77,18.92 41.16,18.92 41.16,15.37 33.77,15.37
VSB on Bottom Layer: 34.4,12.32 41.16,12.32 41.16,8.75 34.4,8.75
VSB on Inner2: 33.62,12.32 41.16,12.32 41.16,8.75 33.62,8.75
VSC on Bottom Layer: 34.65,5.72 40.88,5.72 40.88,1.66 34.65,1.66
VSC on Inner2: 33.77,5.72 40.88,5.72 40.88,1.66 33.77,1.66
$1N39624 on Bottom Layer: 2.59,4.32 10.63,4.32 10.63,0.64 2.59,0.64

Small or netless copper shapes (teardrops, artwork), in the pictures only: 151 on Top Layer, 109 on Bottom Layer, 18 on Inner2

## Text on the board
Bottom Silkscreen Layer: GND | VCC
Top Layer: 2024.4 | 队名XX | 学校XXXX
Top Solder Mask Layer: 队名XX | 学校XXXX | 2024.4
Top Silkscreen Layer: V3.1 | CH32V203C8T6 | FQ6288 | TPN2R703NL | 1808-Fuse-3A | RT9013 | RY9121 | GND | 12V | 2024.4.14 | WCH无刷V3.1
